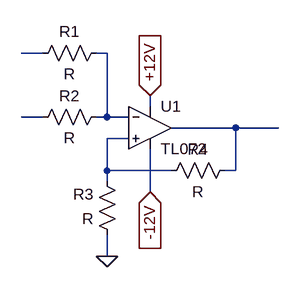
[diagram p0: schematic Draft1.asc]
Draft1.asc, the LTspice schematic file:
Version 4
SHEET 1 880 680
WIRE -240 96 -272 96
WIRE -144 96 -160 96
WIRE -80 176 -80 160
WIRE -240 192 -272 192
WIRE -144 192 -144 96
WIRE -144 192 -160 192
WIRE -112 192 -144 192
WIRE 48 208 -48 208
WIRE 112 208 48 208
WIRE -112 224 -144 224
WIRE -144 272 -144 224
WIRE -48 272 -144 272
WIRE 48 272 48 208
WIRE 48 272 32 272
WIRE -144 288 -144 272
WIRE -80 304 -80 240
WIRE -144 400 -144 368
FLAG -80 160 +12V
IOPIN -80 160 In
FLAG -80 304 -12V
IOPIN -80 304 In
FLAG -144 400 0
SYMBOL OpAmps/TL072 -80 144 R0
SYMATTR InstName U1
SYMBOL Res -144 80 R90
WINDOW 0 0 56 VBottom 2
WINDOW 3 32 56 VTop 2
SYMATTR InstName R1
SYMBOL Res -144 176 R90
WINDOW 0 0 56 VBottom 2
WINDOW 3 32 56 VTop 2
SYMATTR InstName R2
SYMBOL res -128 384 R180
WINDOW 0 36 76 Left 2
WINDOW 3 36 40 Left 2
SYMATTR InstName R3
SYMBOL res 48 256 R90
WINDOW 0 0 56 VBottom 2
WINDOW 3 32 56 VTop 2
SYMATTR InstName R4

The netlist it stands for:
* Draft1.asc
XU1 N005 N002 +12V -12V N004 TL072  ; pins In+ In- V+ V- OUT
R1 N002 N001 R
R2 N002 N003 R
R3 0 N005 R
R4 N004 N005 R
.backanno
.end